# Altium project MDBU020.PrjPcb (part 1 of 2)
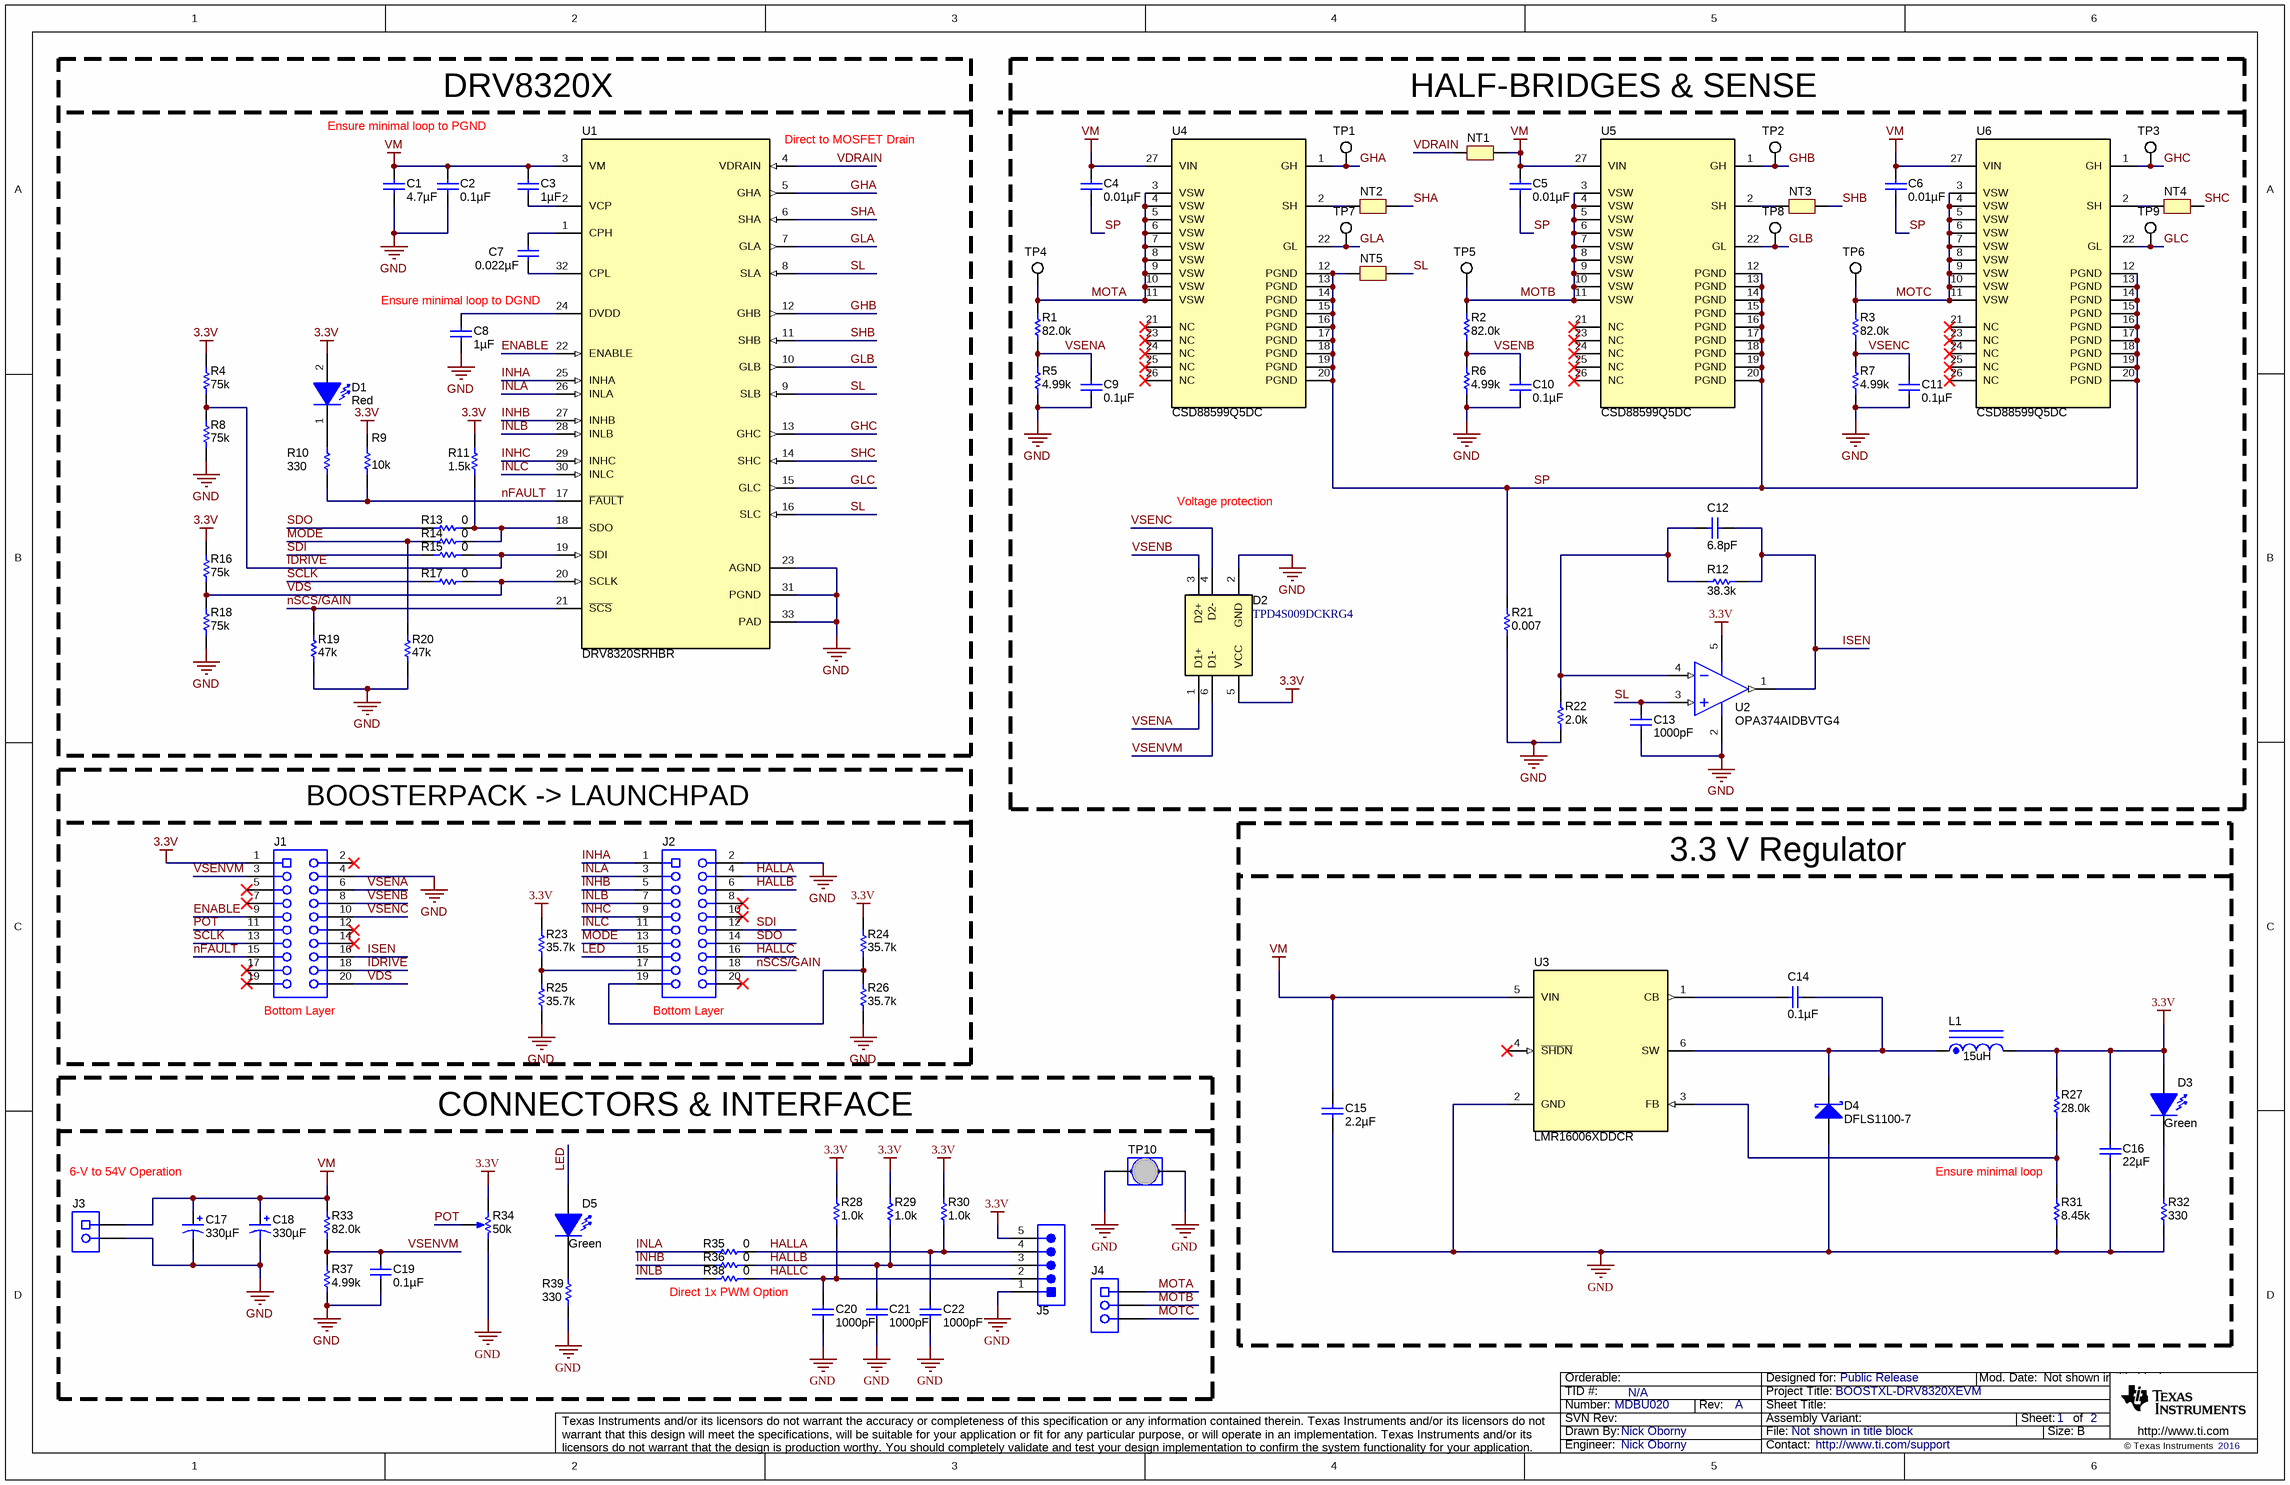
[diagram p0: MDBU020.SchDoc]
CopyrightYear: 2016; PCB_Layout: Nick Oborny, Hector Hernandez; PCB_Rev: A; PRJ_Customer: Public Release; PRJ_Engineer: Nick Oborny; PRJ_Number: MDBU020; PRJ_Title: BOOSTXL-DRV8320XEVM; ProjectVariant: EVM_Orderable; SCH_Rev: A; TechSupport: http://www.ti.com/support; TID: N/A
2 sheets, 106 parts. Net scope: global (net labels, ports and power ports of the same name join across sheets).
Board file: MDBU020.PcbDoc
Sheets:
  MDBU020.SchDoc
  MDBU020_Hardware.SchDoc

## Sheet MDBU020.SchDoc
size 431 x 279 mm; Date: Not shown in title block; ApprovedBy: Not shown in title block; CheckedBy: Not shown in title block; Author: Not shown in title block; CompanyName: Not shown in title block; DrawnBy: Nick Oborny; Engineer: Not shown in title block; Organization: Not shown in title block; Address1: Not shown in title block; Address2: Not shown in title block; Address3: Not shown in title block; Address4: Not shown in title block; DocumentNumber: 1; Revision: Use project parameter SCH_Rev; SheetNumber: 1; SheetTotal: 2; PageSetup: Record=PageOptions|CenterHorizontal=True|CenterVertical=True|PrintScale=1.00|XCorrection=1.00|YCorrection=1.00|PrintKind=0|BorderSize=5000000|LeftOffset=0|BottomOffset=0|Orientation=2|PaperLength=1000|PaperWidth=1000|Scale=100|PaperSource=15|PrintQuality=600|MediaType=1|DitherType=10|PaperKind=Letter|PrintScaleMode=1; CurrentTime: Not shown in title block; CurrentDate: Not shown in title block; Time: Not shown in title block; DocumentFullPathAndName: Not shown in title block; DocumentName: Not shown in title block; ModifiedDate: Not shown in title block; ImagePath: Not shown in title block

### Parts
C1  ValueDisplayed: 4.7µF  [1210_220L]  (hidden comment: CGA6M3X7S2A475K200AB)
C2  ValueDisplayed: 0.1µF  [0603L]  (hidden comment: C1608X7S2A104K080AB)
C3  ValueDisplayed: 1µF  [0603L]  (hidden comment: GRM188R71C105KA12D)
C4  ValueDisplayed: 0.01µF  [0603L]  (hidden comment: GRM188R72A103KA01D)
C5  ValueDisplayed: 0.01µF  [0603L]  (hidden comment: GRM188R72A103KA01D)
C6  ValueDisplayed: 0.01µF  [0603L]  (hidden comment: GRM188R72A103KA01D)
C7  ValueDisplayed: 0.022µF  [0603L]  (hidden comment: C1608X7R2A223K)
C8  ValueDisplayed: 1µF  [0603L]  (hidden comment: GRM188R70J105KA01D)
C9  ValueDisplayed: 0.1µF  [0603L]  (hidden comment: GRM188R71C104KA01D)
C10  ValueDisplayed: 0.1µF  [0603L]  (hidden comment: GRM188R71C104KA01D)
C11  ValueDisplayed: 0.1µF  [0603L]  (hidden comment: GRM188R71C104KA01D)
C12  ValueDisplayed: 6.8pF  [0603L]  (hidden comment: 06035A6R8CAT2A)
C13  ValueDisplayed: 1000pF  [0603L]  (hidden comment: 885012206034)
C14  ValueDisplayed: 0.1µF  [0603L]  (hidden comment: 0603YC104JAT2A)
C15  ValueDisplayed: 2.2µF  [1210_220L]  (hidden comment: GRM32ER72A225KA35L)
C16  ValueDisplayed: 22µF  [1206_180L]  (hidden comment: GRM31CR61A226KE19L)
C17  ValueDisplayed: 330µF  [CAPSMT_62_KG5]  (hidden comment: EMVA630ADA331MKG5S)
C18  ValueDisplayed: 330µF  [CAPSMT_62_KG5]  (hidden comment: EMVA630ADA331MKG5S)
C19  ValueDisplayed: 0.1µF  [0603L]  (hidden comment: C0603C104K4RACTU)
C20  ValueDisplayed: 1000pF  [0603L]  (hidden comment: 885012206034)
C21  ValueDisplayed: 1000pF  [0603L]  (hidden comment: 885012206034)
C22  ValueDisplayed: 1000pF  [0603L]  (hidden comment: 885012206034)
D1  value Red  [WL-SMCW_RED]  (hidden comment: 150060RS75000)
D2  TPD4S009DCKRG4  [DCK0006A_L]
D3  value Green  [LED_LTST-C171]  (hidden comment: LTST-C171GKT)
D4  DFLS1100-7  [PowerDI123]
D5  value Green  [LED_LTST-C171]  (hidden comment: LTST-C171GKT)
J1  SSQ-110-03-G-D  [Samtec_SSQ-110-03-x-D]  (value not drawn)
J2  SSQ-110-03-G-D  [Samtec_SSQ-110-03-x-D]  (value not drawn)
J3  691 101 710 002  [Wurth_691101710002]  (value not drawn)
J4  691 101 710 003  [Wurth_691101710003]  (value not drawn)
J5  PEC05SAAN  [Sullins_PxC05SAAN]  (value not drawn)
L1  value 15uH  [SD53]  (hidden comment: SD53-150-R)
NT1  Net-Tie  [Net-Tie_10mil]  (value not drawn)  (net tie, no BOM)
NT2  Net-Tie  [Net-Tie_10mil]  (value not drawn)  (net tie, no BOM)
NT3  Net-Tie  [Net-Tie_10mil]  (value not drawn)  (net tie, no BOM)
NT4  Net-Tie  [Net-Tie_10mil]  (value not drawn)  (net tie, no BOM)
NT5  Net-Tie  [Net-Tie_10mil]  (value not drawn)  (net tie, no BOM)
R1  ValueDisplayed: 82.0k  [0603L]  (hidden comment: RC0603FR-0782KL)
R2  ValueDisplayed: 82.0k  [0603L]  (hidden comment: RC0603FR-0782KL)
R3  ValueDisplayed: 82.0k  [0603L]  (hidden comment: RC0603FR-0782KL)
R4  ValueDisplayed: 75k  [0603L]  (hidden comment: CRCW060375K0JNEA)
R5  ValueDisplayed: 4.99k  [0603L]  (hidden comment: RC0603FR-074K99L)
R6  ValueDisplayed: 4.99k  [0603L]  (hidden comment: RC0603FR-074K99L)
R7  ValueDisplayed: 4.99k  [0603L]  (hidden comment: RC0603FR-074K99L)
R8  ValueDisplayed: 75k  [0603L]  (hidden comment: CRCW060375K0JNEA)
R9  ValueDisplayed: 10k  [0603L]  (hidden comment: CRCW060310K0JNEA)
R10  value 330  [0603L]  (hidden comment: CRCW0603330RJNEA)
R11  ValueDisplayed: 1.5k  [0603L]  (hidden comment: CRCW06031K50JNEA)
R12  ValueDisplayed: 38.3k  [0603L]  (hidden comment: CRCW060338K3FKEA)
R13  value 0  [0603L]  (hidden comment: CRCW06030000Z0EA)
R14  value 0  [0603L]  (hidden comment: CRCW06030000Z0EA)
R15  value 0  [0603L]  (hidden comment: CRCW06030000Z0EA)
R16  ValueDisplayed: 75k  [0603L]  (hidden comment: CRCW060375K0JNEA)
R17  value 0  [0603L]  (hidden comment: CRCW06030000Z0EA)
R18  ValueDisplayed: 75k  [0603L]  (hidden comment: CRCW060375K0JNEA)
R19  ValueDisplayed: 47k  [0603L]  (hidden comment: CRCW060347K0JNEA)
R20  ValueDisplayed: 47k  [0603L]  (hidden comment: CRCW060347K0JNEA)
R21  ValueDisplayed: 0.007  [2512L]  (hidden comment: CRE2512-FZ-R007E-3)
R22  ValueDisplayed: 2.0k  [0603L]  (hidden comment: CRCW06032K00JNEA)
R23  ValueDisplayed: 35.7k  [0603L]  (hidden comment: RC0603FR-0735K7L)
R24  ValueDisplayed: 35.7k  [0603L]  (hidden comment: RC0603FR-0735K7L)
R25  ValueDisplayed: 35.7k  [0603L]  (hidden comment: RC0603FR-0735K7L)
R26  ValueDisplayed: 35.7k  [0603L]  (hidden comment: RC0603FR-0735K7L)
R27  ValueDisplayed: 28.0k  [0603L]  (hidden comment: CRCW060328K0FKEA)
R28  ValueDisplayed: 1.0k  [0603L]  (hidden comment: CRCW06031K00JNEA)
R29  ValueDisplayed: 1.0k  [0603L]  (hidden comment: CRCW06031K00JNEA)
R30  ValueDisplayed: 1.0k  [0603L]  (hidden comment: CRCW06031K00JNEA)
R31  ValueDisplayed: 8.45k  [0603L]  (hidden comment: CRCW06038K45FKEA)
R32  ValueDisplayed: 330  [0603L]  (hidden comment: RC0603JR-07330RL)
R33  ValueDisplayed: 82.0k  [0603L]  (hidden comment: RC0603FR-0782KL)
R34  value 50k  [Bourns_3352T]  (hidden comment: 3352T-1-503LF)
R35  value 0  [0603L]  (hidden comment: CRCW06030000Z0EA)
R36  value 0  [0603L]  (hidden comment: CRCW06030000Z0EA)
R37  ValueDisplayed: 4.99k  [0603L]  (hidden comment: RC0603FR-074K99L)
R38  value 0  [0603L]  (hidden comment: CRCW06030000Z0EA)
R39  value 330  [0603L]  (hidden comment: CRCW0603330RJNEA)
TP1  5002  [Keystone5002]  (value not drawn)
TP2  5002  [Keystone5002]  (value not drawn)
TP3  5002  [Keystone5002]  (value not drawn)
TP4  5002  [Keystone5002]  (value not drawn)
TP5  5002  [Keystone5002]  (value not drawn)
TP6  5002  [Keystone5002]  (value not drawn)
TP7  5002  [Keystone5002]  (value not drawn)
TP8  5002  [Keystone5002]  (value not drawn)
TP9  5002  [Keystone5002]  (value not drawn)
TP10  D3082-05  [Harwin_D3082-05]  (value not drawn)
U1  DRV8320SRHBR  [RHB0032E]
U2  OPA374AIDBVTG4  [DBV0005A_L]
U3  LMR16006XDDCR  [DDC0006A_L]
U4  CSD88599Q5DC  [DMM0022A]
U5  CSD88599Q5DC  [DMM0022A]
U6  CSD88599Q5DC  [DMM0022A]

### Blocks framed on the sheet
DRV8320X: C1-C3 C7 C8 D1 R4 R8-R11 R13-R20 U1
HALF-BRIDGES & SENSE: C4-C6 C9-C13 D2 NT1-NT5 R1-R3 R5-R7 R12 R21 R22 TP1-TP9 U2 U4-U6
BOOSTERPACK -> LAUNCHPAD: J1 J2 R23-R26
3.3 V Regulator: C14-C16 D3 D4 L1 R27 R31 R32 U3
CONNECTORS & INTERFACE: C17-C22 D5 J3-J5 R28-R30 R33-R39 TP10

### Nets
3.3V: C16.1 D1.2(A) D2.5(VCC) D3.1(A) J1.1 J5.5 L1.2 R4.2 R9.2 R11.2 R16.2 R23.2 R24.2 R27.2 R28.2 R29.2 R30.2 R34.3(CW) U2.5(V+)
GND: C1.2 C2.2 C8.2 C9.2 C10.2 C11.2 C13.2 C15.2 C16.2 C17.2(-) C18.2(-) C19.2 C20.2 C21.2 C22.2 D2.2(GND) D4.2(A) J1.4 J2.2 J3.2 J5.1 R5.1 R6.1 R7.1 R8.1 R18.1 R19.1 R20.1 R21.1 R22.1 R25.1 R26.1 R31.1 R32.1 R34.1(CCW) R37.1 R39.1 TP10.1 TP10.2 U1.23(AGND) U1.31(PGND) U1.33(PAD) U2.2(V-) U3.2(GND)
VM: C1.1 C2.1 C3.1 C4.1 C5.1 C6.1 C15.1 C17.1(+) C18.1(+) J3.1 NT1.2 R33.2 U1.3(VM) U3.5(VIN) U4.27(VIN) U5.27(VIN) U6.27(VIN)
ENABLE: J1.9 U1.22(ENABLE)
GHA: TP1.1 U1.5(GHA) U4.1(GH)
GHB: TP2.1 U1.12(GHB) U5.1(GH)
GHC: TP3.1 U1.13(GHC) U6.1(GH)
GLA: TP7.1 U1.7(GLA) U4.22(GL)
GLB: TP8.1 U1.10(GLB) U5.22(GL)
GLC: TP9.1 U1.15(GLC) U6.22(GL)
HALLA: C22.1 J2.4 J5.4 R30.1 R35.1
HALLB: C21.1 J2.6 J5.3 R29.1 R36.1
HALLC: C20.1 J2.16 J5.2 R28.1 R38.1
IDRIVE: J1.18 R4.1 R8.2 R15.1 U1.19(SDI)
INHA: J2.1 U1.25(INHA)
INHB: J2.5 R36.2 U1.27(INHB)
INHC: J2.9 U1.29(INHC)
INLA: J2.3 R35.2 U1.26(INLA)
INLB: J2.7 R38.2 U1.28(INLB)
INLC: J2.11 U1.30(INLC)
ISEN: C12.1 J1.16 R12.1 U2.1(OUT)
LED: D5.1(A) J2.15
MODE: J2.13 R14.2 R20.2
MOTA: J4.1 R1.2 TP4.1 U4.3(VSW) U4.4(VSW) U4.5(VSW) U4.6(VSW) U4.7(VSW) U4.8(VSW) U4.9(VSW) U4.10(VSW) U4.11(VSW)
MOTB: J4.2 R2.2 TP5.1 U5.3(VSW) U5.4(VSW) U5.5(VSW) U5.6(VSW) U5.7(VSW) U5.8(VSW) U5.9(VSW) U5.10(VSW) U5.11(VSW)
MOTC: J4.3 R3.2 TP6.1 U6.3(VSW) U6.4(VSW) U6.5(VSW) U6.6(VSW) U6.7(VSW) U6.8(VSW) U6.9(VSW) U6.10(VSW) U6.11(VSW)
nFAULT: J1.15 R9.1 R10.1 U1.17(~{FAULT})
nSCS/GAIN: J2.18 R19.2 U1.21(~{SCS})
POT: J1.11 R34.2(WIPER)
SCLK: J1.13 R17.2
SDI: J2.12 R15.2
SDO: J2.14 R13.2
SHA: NT2.2 U1.6(SHA)
SHB: NT3.2 U1.11(SHB)
SHC: NT4.2 U1.14(SHC)
SL: C13.1 NT5.2 U1.8(SLA) U1.9(SLB) U1.16(SLC) U2.3(IN+)
SP: C4.2 C5.2 C6.2 NT5.1 R21.2 U4.12(PGND) U4.13(PGND) U4.14(PGND) U4.15(PGND) U4.16(PGND) U4.17(PGND) U4.18(PGND) U4.19(PGND) U4.20(PGND) U5.12(PGND) U5.13(PGND) U5.14(PGND) U5.15(PGND) U5.16(PGND) U5.17(PGND) U5.18(PGND) U5.19(PGND) U5.20(PGND) U6.12(PGND) U6.13(PGND) U6.14(PGND) U6.15(PGND) U6.16(PGND) U6.17(PGND) U6.18(PGND) U6.19(PGND) U6.20(PGND)
VDRAIN: NT1.1 U1.4(VDRAIN)
VDS: J1.20 R16.1 R17.1 R18.2 U1.20(SCLK)
VSENA: C9.1 D2.1(D1+) J1.6 R1.1 R5.2
VSENB: C10.1 D2.3(D2+) J1.8 R2.1 R6.2
VSENC: C11.1 D2.4(D2-) J1.10 R3.1 R7.2
VSENVM: C19.1 D2.6(D1-) J1.3 R33.1 R37.2
NetC3_2: C3.2 U1.2(VCP)
NetC7_1: C7.1 U1.1(CPH)
NetC7_2: C7.2 U1.32(CPL)
NetC8_1: C8.1 U1.24(DVDD)
NetC12_2: C12.2 R12.2 R22.2 U2.4(IN-)
NetC14_1: C14.1 U3.1(CB)
NetC14_2: C14.2 D4.1(K) L1.1 U3.6(SW)
NetD1_1: D1.1(K) R10.2
NetD3_2: D3.2(K) R32.2
NetD5_2: D5.2(K) R39.2
NetJ2_17: J2.17 R23.1 R25.2
NetJ2_19: J2.19 R24.1 R26.2
NetNT2_1: NT2.1 U4.2(SH)
NetNT3_1: NT3.1 U5.2(SH)
NetNT4_1: NT4.1 U6.2(SH)
NetR11_1: R11.1 R13.1 R14.1 U1.18(SDO)
NetR27_1: R27.1 R31.2 U3.3(FB)

Not connected (* = marked no-connect by the designer): J1 2* 5* 7* 12* 14* 17* 19*; J2 8* 10* 20*; U3 4(~{SHDN})*; U4 21(NC)* 23(NC)* 24(NC)* 25(NC)* 26(NC)*; U5 21(NC)* 23(NC)* 24(NC)* 25(NC)* 26(NC)*; U6 21(NC)* 23(NC)* 24(NC)* 25(NC)* 26(NC)*

### Notes on the sheet
- Ensure minimal loop to PGND
- (near U1) Direct to MOSFET Drain
- Ensure minimal loop to DGND
- Voltage protection
- (near J1) Bottom Layer
- (near J2) Bottom Layer
- 6-V to 54V Operation
- (near R31) Ensure minimal loop
- (near R38) Direct 1x PWM Option
- Drawn By:
- SVN Rev:
- Number:
- TID #:
- Orderable:
- Rev:
- Sheet Title:
- File:
- Project Title:
- Designed for:
- Assembly Variant:
- Mod. Date:
- Sheet:
- Size:
- of
- B
- http://www.ti.com
- Texas Instruments and/or its licensors do not warrant the accuracy or completeness of this specification or any information contained therein. Texas Instruments and/or its licensors do not warrant that this design will meet the specifications, will be suitable for your application or fit for any particular purpose, or will operate in an implementation. Texas Instruments and/or its licensors do not warrant that the design is production worthy. You should completely validate and test your design implementation to confirm the system functionality for your application.
- Engineer:
- Contact:
- © Texas Instruments